# Altium schematic sheet USB3_CON.SchDoc: RFSoC AMC
size 420 x 297 mm; CmpIndex: 25; CompanyName: WUT; DrawnBy: T. Przywozki; Organization: WUT ISE; Address1: Warsaw University of Technology; Address2: Nowowiejska 15/19 00-665 Warsaw; Address3: Tomasz.Przywozki@pw.edu.pl; DocumentNumber: 36; Revision: 1; SheetNumber: 36; SheetTotal: 45; Project: RFSoC AMC; ModifiedBy: T. Przywozki; CreateDate: -; CheckedDate: -; DivGrp: ISE; Designer: T. Przywozki; ModifiedDate: -; ProjectName: ADC/DAC MEZZANINE
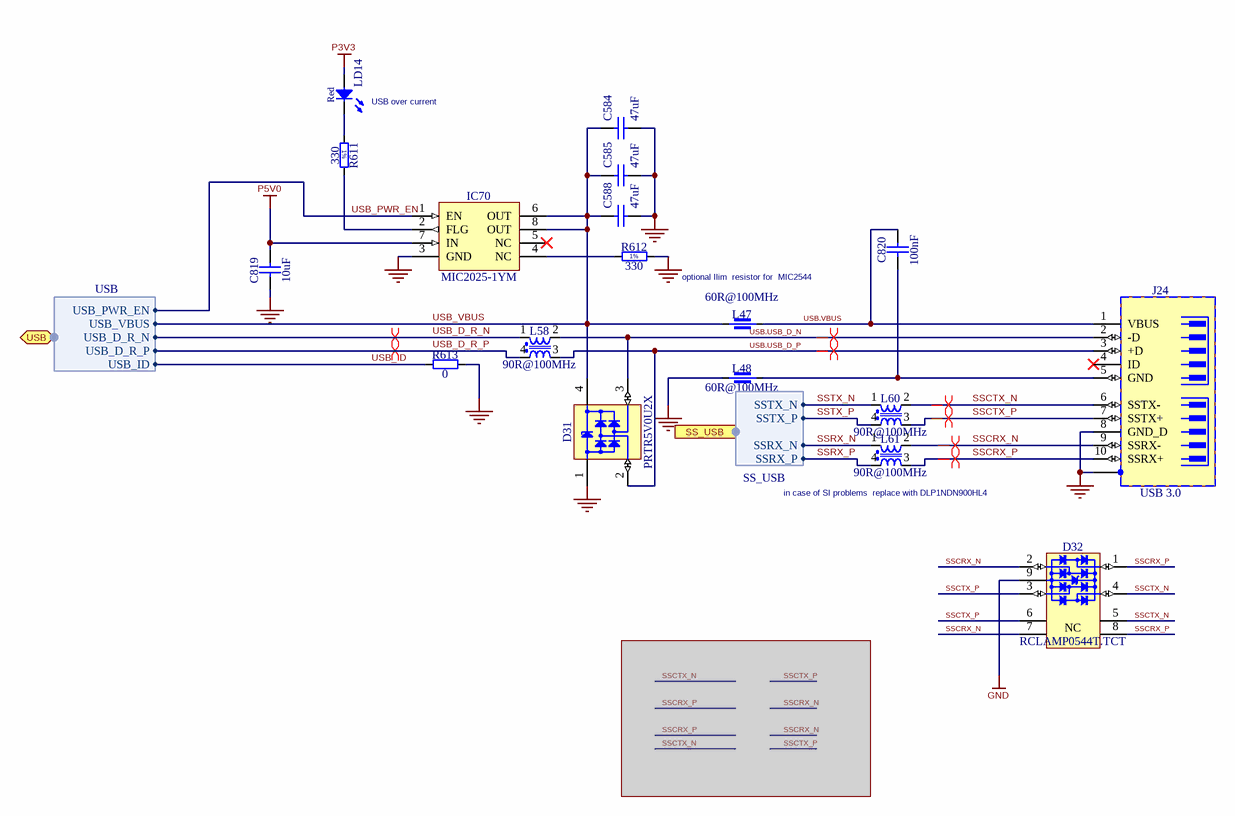
[diagram p0: USB3_CON.SchDoc]

## Parts
C584  47uF  [CAPC2012X140N]
C585  47uF  [CAPC2012X140N]
C588  47uF  [CAPC2012X140N]
C819  10uF  [CAPC1608X87N]
C820  100nF  [CAPC0603X33N]
D31  PRTR5V0U2X  [SOT190P230X110-4N]
D32  RCLAMP0544T.TCT  [SEMTECH_RCLAMP0544T.TCT]
IC70  MIC2025-1YM  [SOIC127P600X175-8N]
J24  USB 3.0  [WURTH_692622030100]
L47  60R@100MHz  [INDC4516X180N]
L48  60R@100MHz  [INDC4516X180N]
L58  90R@100MHz  [IND_MURATA_DLW21S]
L60  90R@100MHz  [IND_MURATA_DLW21S]
L61  90R@100MHz  [IND_MURATA_DLW21S]
LD14  Red  [LED_AVAGO_HSMC-C120]
R611  330  [RESC1005X40N]
R612  330  [RESC1005X40N]
R613  0  [RESC1005X40N]

## Ports
SS_USB (harness SS_USB), USB (bidir, harness USB)

## Harnesses
SS_USB: SSRX_P, SSTX_N, SSTX_P, SSRX_N
USB: USB_D_R_P, USB_PWR_EN, USB_VBUS, USB_D_R_N, USB_ID

## Nets
GND: C584.1 C585.1 C588.1 C819.1 D31.1(GND) D32.9(GND) IC70.3(GND) J24.8(GND_D) J24.11(SHIELD) L48.1 R612.2 R613.2
P3V3: LD14.2(A)
P5V0: C819.2 IC70.7(IN)
SSCRX_N: D32.2(I/O2) D32.7(NC) J24.9(SSRX-) L61.2
SSCRX_P: D32.1(I/O1) D32.8(NC) J24.10(SSRX+) L61.3
SSCTX_N: D32.4(I/O4) D32.5(NC) J24.6(SSTX-) L60.2
SSCTX_P: D32.3(I/O3) D32.6(NC) J24.7(SSTX+) L60.3
SSRX_N: L61.1 ; port SS_USB.SSRX_N
SSRX_P: L61.4 ; port SS_USB.SSRX_P
SSTX_N: L60.1 ; port SS_USB.SSTX_N
SSTX_P: L60.4 ; port SS_USB.SSTX_P
USB.USB_D_N: D31.3(I/O2) J24.2(-D) L58.2
USB.USB_D_P: D31.2(I/O1) J24.3(+D) L58.3
USB.VBUS: C820.2 J24.1(VBUS) L47.2
USB_D_R_N: L58.1 ; port USB.USB_D_R_N
USB_D_R_P: L58.4 ; port USB.USB_D_R_P
USB_ID: R613.1 ; port USB.USB_ID
USB_PWR_EN: IC70.1(EN) ; port USB.USB_PWR_EN
USB_VBUS: C584.2 C585.2 C588.2 D31.4(VCC) IC70.6(OUT) IC70.8(OUT) L47.1 ; port USB.USB_VBUS
NetC820_1: C820.1 J24.5(GND) L48.2
NetIC70_2: IC70.2(FLG) R611.2
NetIC70_4: IC70.4(NC) R612.1
NetLD14_1: LD14.1(C) R611.1

Not connected (* = marked no-connect by the designer): IC70 5(NC)*; J24 4(ID)*

## Layout directives
differential pair; differential pair class 90ohm: SSCRX_N, SSCRX_P, SSCTX_N, SSCTX_P, USB.USB_D_N, USB.USB_D_P, USB_D_R_N, USB_D_R_P

## Notes on the sheet
- USB over current
- optional Ilim  resistor for  MIC2544
- (near L61) in case of SI problems  replace with DLP1NDN900HL4
- Project/Equipment
- Document
- Designer
- Drawn by
- Check.by
- Copyright WUT ISE 2021
  This documentation describes Open Hardware and is licensed under CERN OHL v.1.1. You may redistribute and modify this documentaction under the terms of the CERN OHL v1.1.
  (http://ohwr.org/CERNOHL). This documentation is dristributed WITHOUT ANY EXPRESS OR IMPLIED WARRANTY, INCLUDING OF MERCHANTABLITY, SATISFACTORY QUALITY AND FITNESS FOR A PARTICULAR PURPOSE. Please see the CERN OHL v.1.1 for applicable conditions
- File
- Last Mod.
- Print Date
- Sheet
- Size
- A3
- of
- Rev
- Contact:
- (in symbol R0402_330R_1%_0.0625W_100PPM) 1%

## Library data of the parts
C584 C585 C588 = CC0805_47UF_6.3V_20%_X5R: Non-polarised capacitor; Manufacturer: GENERIC; Part Description: SMD Multilayer Chip Ceramic Capacitor; Manufacturer1 Part Number: C0805C476M9PACTU; Tolerance: ±20%; Voltage: 6.3V; TC: X5R; Manufacturer Part Number: CC0805_47UF_6.3V_20%_X5R; Part Number: CC0805_47UF_6.3V_20%_X5R; Value: 47uF; Component Kind: Standard; Component Type: Standard; Pin Count: 2; Status: Preferred; Case: 0805; Mounted: Yes; Socket: No; SMD: Yes; Sense: No; Manufacturer1 Example: KEMET; Manufacturer1 ComponentHeight: 1.4mm; HelpURL: \\cern.ch\dfs\Applications\Altium\Datasheets\CC0805_X5R_KEMET.pdf; Author: CERN DEM JLC; CreateDate: 16/10/2012; LatestRevisionDate: 16/10/2012
C819 = CC0603_10uF_6.3V_20%_X5R: Non-polarised capacitor; Manufacturer: GENERIC; Part Description: SMD Multilayer Chip Ceramic Capacitor; Manufacturer1 Part Number: C0603C106M9PAC; Tolerance: ±20%; Voltage: 6.3V; TC: X5R; Manufacturer Part Number: CC0603_10uF_6.3V_20%_X5R; Part Number: CC0603_10UF_6.3V_20%_X5R; Value: 10uF; Component Kind: Standard; Component Type: Standard; Pin Count: 2; Status: Preferred; Case: 0603; Mounted: Yes; Socket: No; SMD: Yes; Sense: No; Manufacturer1 Example: KEMET; Manufacturer1 ComponentHeight: 0.95mm; HelpURL: \\cern.ch\dfs\Applications\Altium\Datasheets\CC0603_X5R_KEMET.pdf; Author: CERN DEM JLC; CreateDate: 03.12.2007; LatestRevisionDate: 03.12.2007
C820 = CC0201_100NF_6.3V_10%_X5R: Non-polarised capacitor; Manufacturer: GENERIC; Part Description: SMD Multilayer Chip Ceramic Capacitor; Manufacturer1 Part Number: 02016D104KAT2A; Tolerance: ±10%; Voltage: 6.3V; TC: X5R; Manufacturer Part Number: CC0201_100NF_6.3V_10%_X5R; Part Number: CC0201_100NF_6.3V_10%_X5R; Value: 100nF; Component Kind: Standard; Component Type: Standard; Pin Count: 2; Status: Not Recommended; Case: 0201; Mounted: Yes; Socket: No; SMD: Yes; Sense: No; Manufacturer1 Example: AVX; Manufacturer1 ComponentHeight: 0.33mm; HelpURL: \\cern.ch\dfs\Applications\Altium\Datasheets\CC0201_X5R_AVX.pdf; Author: CERN DEM JLC; CreateDate: 03.12.2007; LatestRevisionDate: 03.12.2007
D31 = PRTR5V0U2X: Ultra Low Capacitance Double Rail-to-Rail ESD Protection Diode; Manufacturer: NXP SEMICONDUCTORS; Part Description: Ultra Low Capacitance (1pF) Double Rail-to-Rail ESD Protection Diode (8kV); Voltage: 5.5V; PressFit: No; Bonding: No; Manufacturer Part Number: PRTR5V0U2X; PackageDescription: SOT143B, SOT, 1.90mm Pitch; 4 Pin, 1.30mm W X 2.90mm L X 1.10mm H body, IPC Medium Density; Part Number: PRTR5V0U2X; Component Kind: Standard; Component Type: Standard; Device: PRTR5V0U2X; Pin Count: 4; Case: SOT143B; Mounted: Yes; Socket: No; SMD: Yes; Sense: No; ComponentHeight: 1.1mm; HelpURL: \\cern.ch\dfs\Applications\Altium\Datasheets\PRTR5V0U2X.pdf; Author: CERN DEM JLC; CreateDate: 22.03.2011; LatestRevisionDate: 22.03.2011
D32 = RCLAMP0544T.TCT: Ultra Large Bandwidth HDMI ESD Protection; Manufacturer: SEMTECH; Part Description: RailClamp® Ultra Low Capacitance TVS Arrays, ESD (15kV) Protection; Power: 75W; PressFit: No; Bonding: No; Manufacturer Part Number: RCLAMP0544T.TCT; PackageDescription: SON, 0.40mm Pitch; 9 Pin, 1.00mm W X 2.00mm L X 0.43mm H Body, IPC Medium Density; Part Number: RCLAMP0544T.TCT; Component Kind: Standard; Component Type: Standard; Device: RCLAMP0544T.TCT; Pin Count: 9; Case: SON10; Mounted: Yes; Socket: No; SMD: Yes; Sense: No; ComponentHeight: 0.43mm; HelpURL: \\cern.ch\dfs\Applications\Altium\Datasheets\RCLAMP0544T-TCT.pdf; Author: CERN DEM MR; CreateDate: 08.07.2016; LatestRevisionDate: 08.07.2016
IC70 = MIC2025-1YM: Single-Channel Power Distribution Switch MM8®; Manufacturer: MICREL; PressFit: No; Bonding: No; Manufacturer Part Number: MIC2025-1YM; PackageDescription: SOIC 8, Pitch 1.27mm - Body 4x5mm, IPC Medium Density; Part Description: Single-Channel Power Distribution Switch MM8®; Part Number: MIC2025-1YM; Component Kind: Standard; Component Type: Standard; Device: MIC2025-1YM; Pin Count: 8; Case: SOIC8; Mounted: Yes; Socket: No; SMD: Yes; Sense: No; ComponentHeight: 1.75mm; Author: CERN DEM JLC; HelpURL: \\cern.ch\dfs\Applications\Altium\Datasheets\MIC2025-1YM.pdf; CreateDate: 23.07.2014; LatestRevisionDate: 23.07.2014
J24 = WURTH_692622030100: 10 Pin + 1 Shield Micro-USB 3.0 Type B Receptacle; Part Description: USB 3.0 Type B Horizontal Receptacle; Manufacturer: WURTH ELEKTRONIK; PressFit: No; Part Number: WURTH_692622030100; Component Kind: Standard; Component Type: Standard; Pin Count: 11; Family: USB 3.0; Mounted: Yes; Socket: No; SMD: Yes; Sense: No; Status: None; Manufacturer Part Number: 692622030100; ComponentHeight: 2.85mm; HelpURL: \\cern.ch\dfs\Applications\Altium\Datasheets\WURTH_692622030100.pdf; Author: CERN DEM JLC; CreateDate: 15.03.2017; LatestRevisionDate: 15.03.2017
L47 L48 = IND1806_MURATA_BLM41PG600SN1L: Part Description: SMD EMI Suppression Chip Ferrite Bead (BLM41P Series); Manufacturer: MURATA; Power: 6A; Resistance: 0.01R; Part Number: IND1806_MURATA_BLM41PG600SN1L; Component Kind: Standard; Component Type: Standard; Pin Count: 2; Value: 60R@100MHz; Status: None; Manufacturer Part Number: BLM41PG600SN1L; Case: 1806; Mounted: Yes; Socket: No; SMD: Yes; Sense: No; ComponentHeight: 1.8mm; HelpURL: \\cern.ch\dfs\Applications\Altium\Datasheets\IND1806_MURATA_BLM41P.pdf; Author: CERN DEM JLC; CreateDate: 02.12.2009; LatestRevisionDate: 02.12.2009
L58 L60 L61 = IND_MURATA_DLW21SN900SQ2L: Inductor Common Mode; Manufacturer: MURATA; Part Description: Wire Wound Common Mode Choke Coil (DLW21S Series); Tolerance: ±25%; Power: 330mA; Resistance: 0.35R; Manufacturer Part Number: DLW21SN900SQ2L; Part Number: IND_MURATA_DLW21SN900SQ2L; Value: 90R@100MHz; Component Kind: Standard; Component Type: Standard; Pin Count: 4; Status: None; Case: 0805; Mounted: Yes; Socket: No; SMD: Yes; Sense: No; ComponentHeight: 1.4mm; HelpURL: \\cern.ch\dfs\Applications\Altium\Datasheets\IND_MURATA_DLW21S.pdf; Author: CERN DEM JLC; CreateDate: 01.07.2014; LatestRevisionDate: 01.07.2014
LD14 = LED_AVAGO_HSMC-C120: LED Red 1C 2A; Manufacturer: AVAGO TECHNOLOGIES; Part Description: High Performance Right Angle Chip Red LED; PressFit: No; Bonding: No; Manufacturer Part Number: HSMC-C120; PackageDescription: Red Chip LED, 2-Leads, Body 1.7x1.1mm, Side Emitting Package; Part Number: LED_AVAGO_HSMC-C120; Component Kind: Standard; Component Type: Standard; Color: Red; Pin Count: 2; Mounted: Yes; Socket: No; SMD: Yes; Sense: No; ComponentHeight: 0.7mm; HelpURL: \\cern.ch\dfs\Applications\Altium\Datasheets\LED_AVAGO_HSMC-C120.pdf; ComponentLink1URL: \\cern.ch\dfs\Applications\Altium\Datasheets\LED_AVAGO_HSMC-C120_DESIGN-GUIDE.pdf; ComponentLink1Description: Design Guide; Author: CERN DEM JMW; CreateDate: 22.07.2009; LatestRevisionDate: 20.06.2012
R611 R612 = R0402_330R_1%_0.0625W_100PPM: Resistor - 1%; Manufacturer: GENERIC; Part Description: General Purpose Thick Film Chip Resistor; Manufacturer1 Part Number: 232270673301L; TC: ±100ppm/°C; PressFit: No; Manufacturer Part Number: R0402_330R_1%_0.0625W_100PPM; Part Number: R0402_330R_1%_0.0625W_100PPM; Tolerance: ±1%; Value: 330; Component Kind: Standard; Component Type: Standard; Pin Count: 2; Status: Not Recommended; Power: 0.0625W; Case: 0402; Mounted: Yes; Sense: No; Socket: No; SMD: Yes; Manufacturer1 Example: YAGEO PHYCOMP; Manufacturer1 ComponentHeight: 0.4mm; HelpURL: \\cern.ch\dfs\Applications\Altium\Datasheets\R0402_Phycomp_RC0402.pdf; Author: CERN DEM JLC; CreateDate: 03.12.2007; LatestRevisionDate: 17.10.2012
R613 = R0402_0R_JUMPER: Resistor; Manufacturer: GENERIC; Part Description: 1A (0.05R Max DC Resistance) Zero Ohm Jumper; Manufacturer1 Part Number: 232270591001L; PressFit: No; Manufacturer Part Number: R0402_0R_JUMPER; Part Number: R0402_0R_JUMPER; Value: 0; Component Kind: Standard; Component Type: Standard; Pin Count: 2; Status: Not Recommended; Case: 0402; Mounted: Yes; Sense: No; Socket: No; SMD: Yes; Manufacturer1 Example: YAGEO PHYCOMP; Manufacturer1 ComponentHeight: 0.4mm; HelpURL: \\cern.ch\dfs\Applications\Altium\Datasheets\R0402_Phycomp_RC0402.pdf; Author: CERN DEM JLC; CreateDate: 03.12.2007; LatestRevisionDate: 17.10.2012